# EAGLE board CDevBoard (EAGLE 9.6.2), part 1 of 2
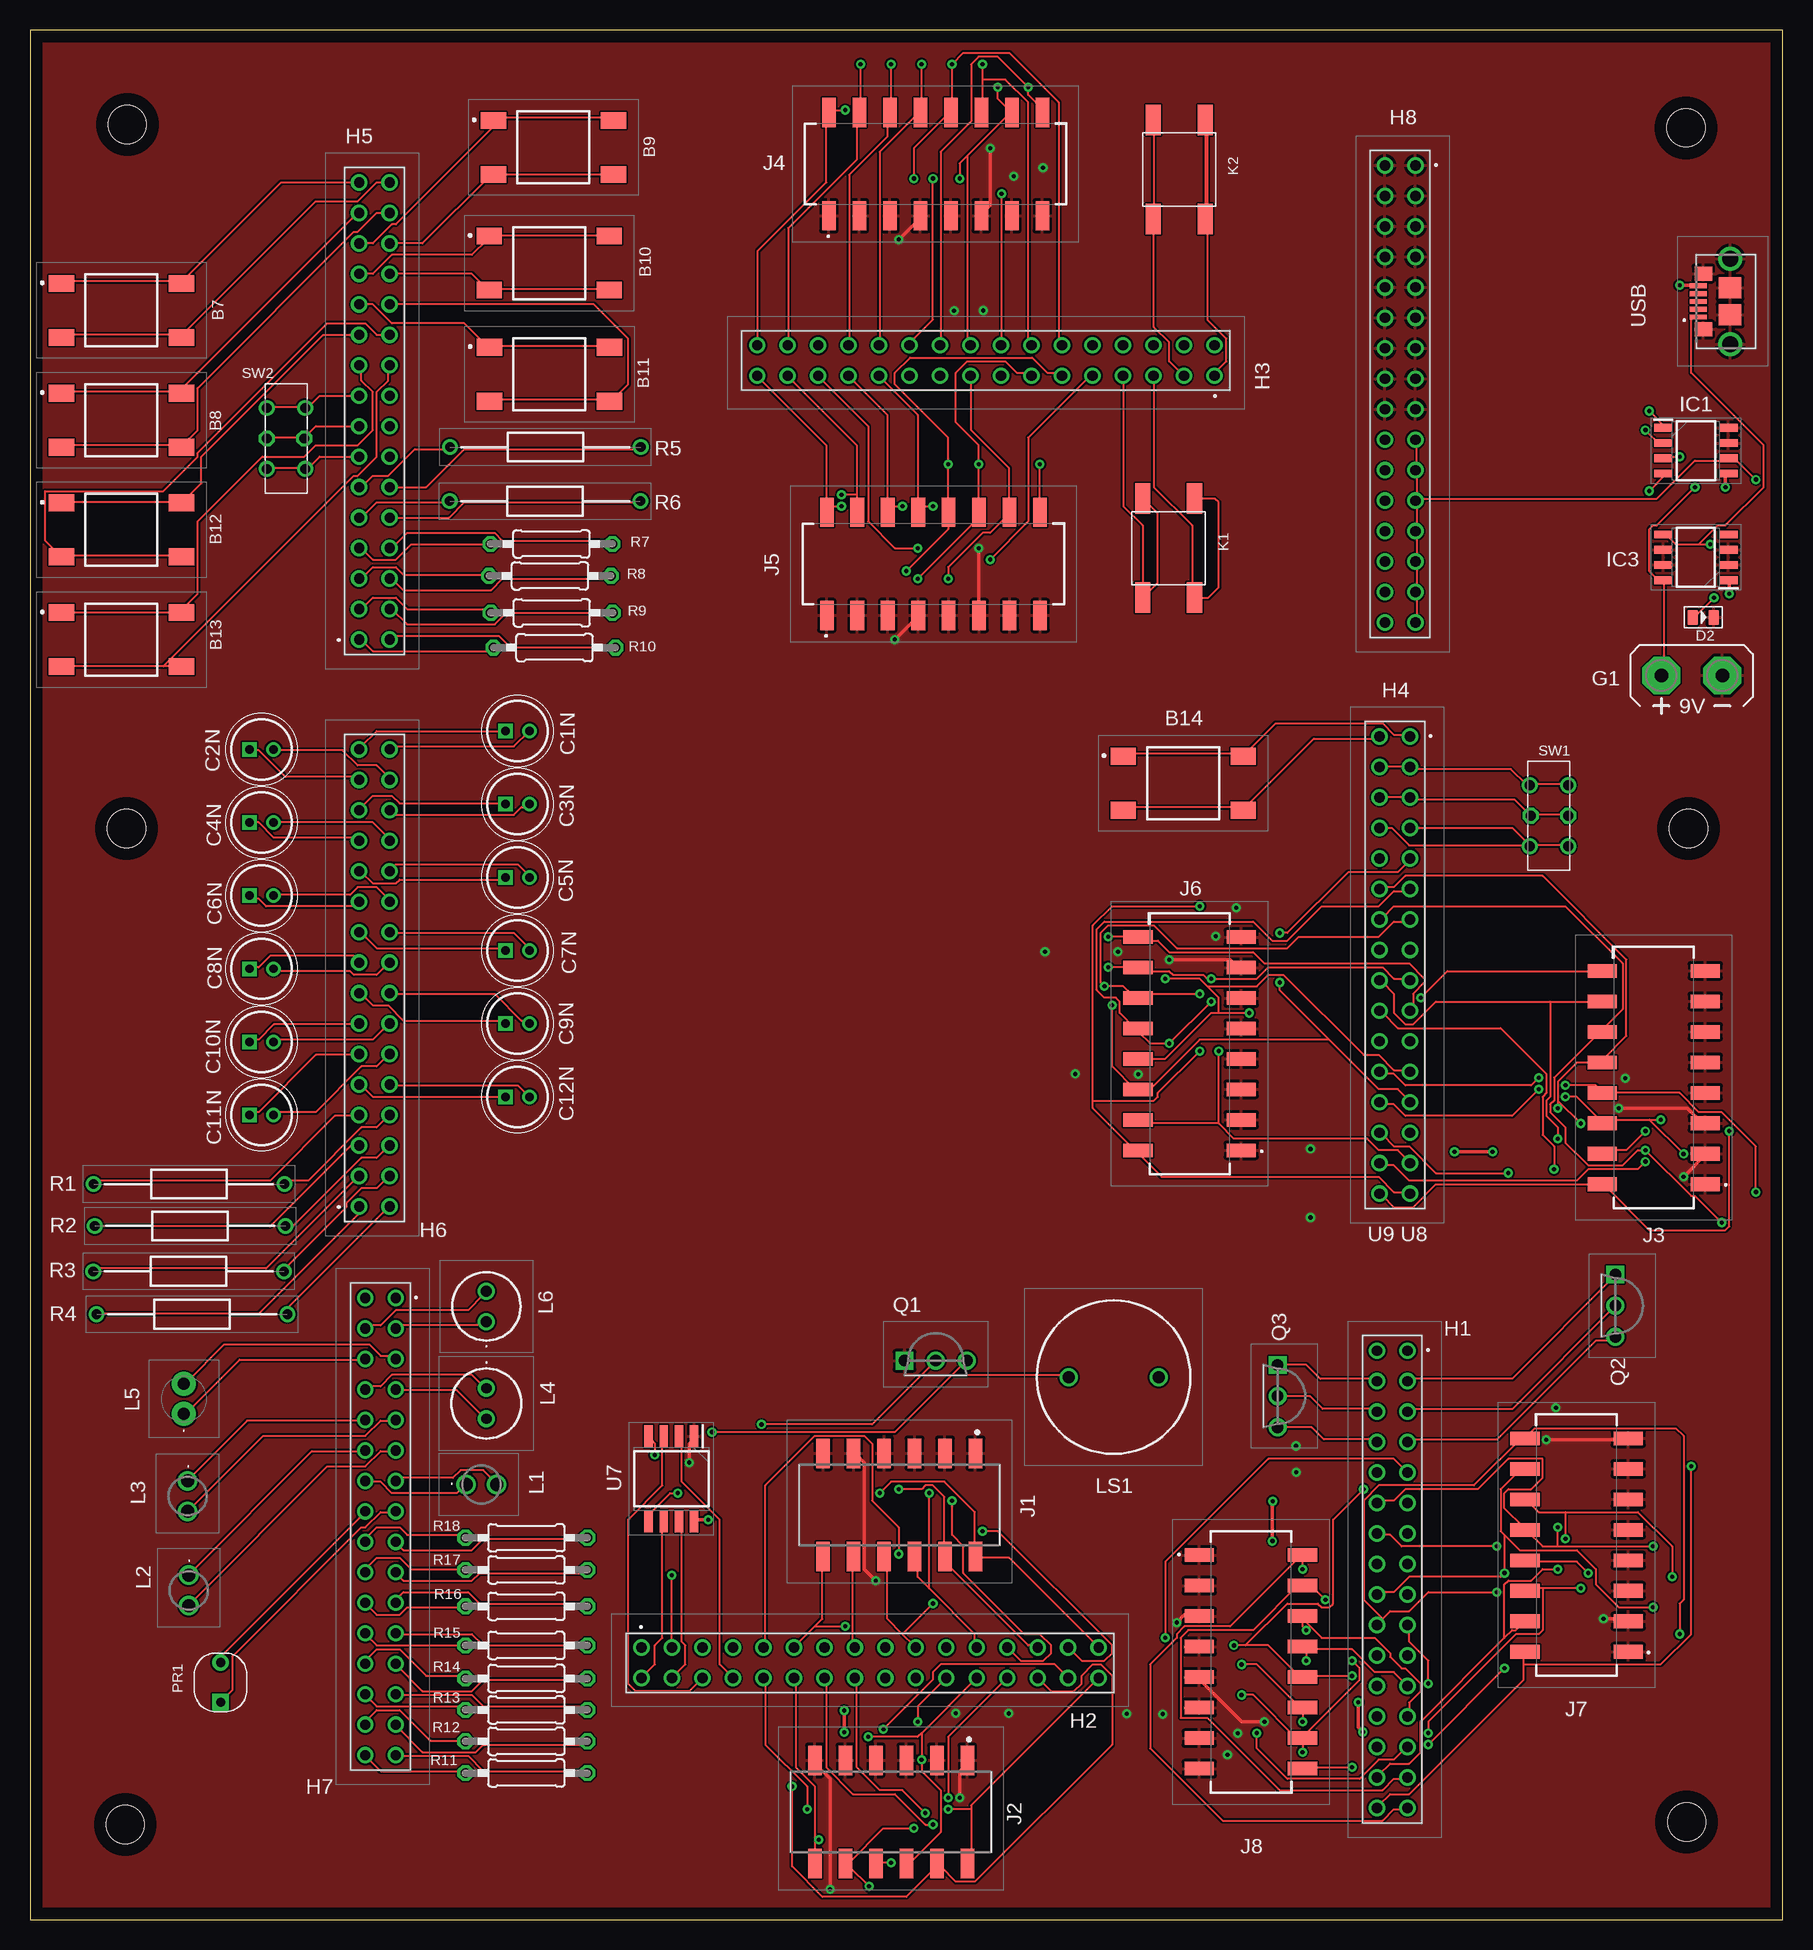
[diagram p2: board, top side]
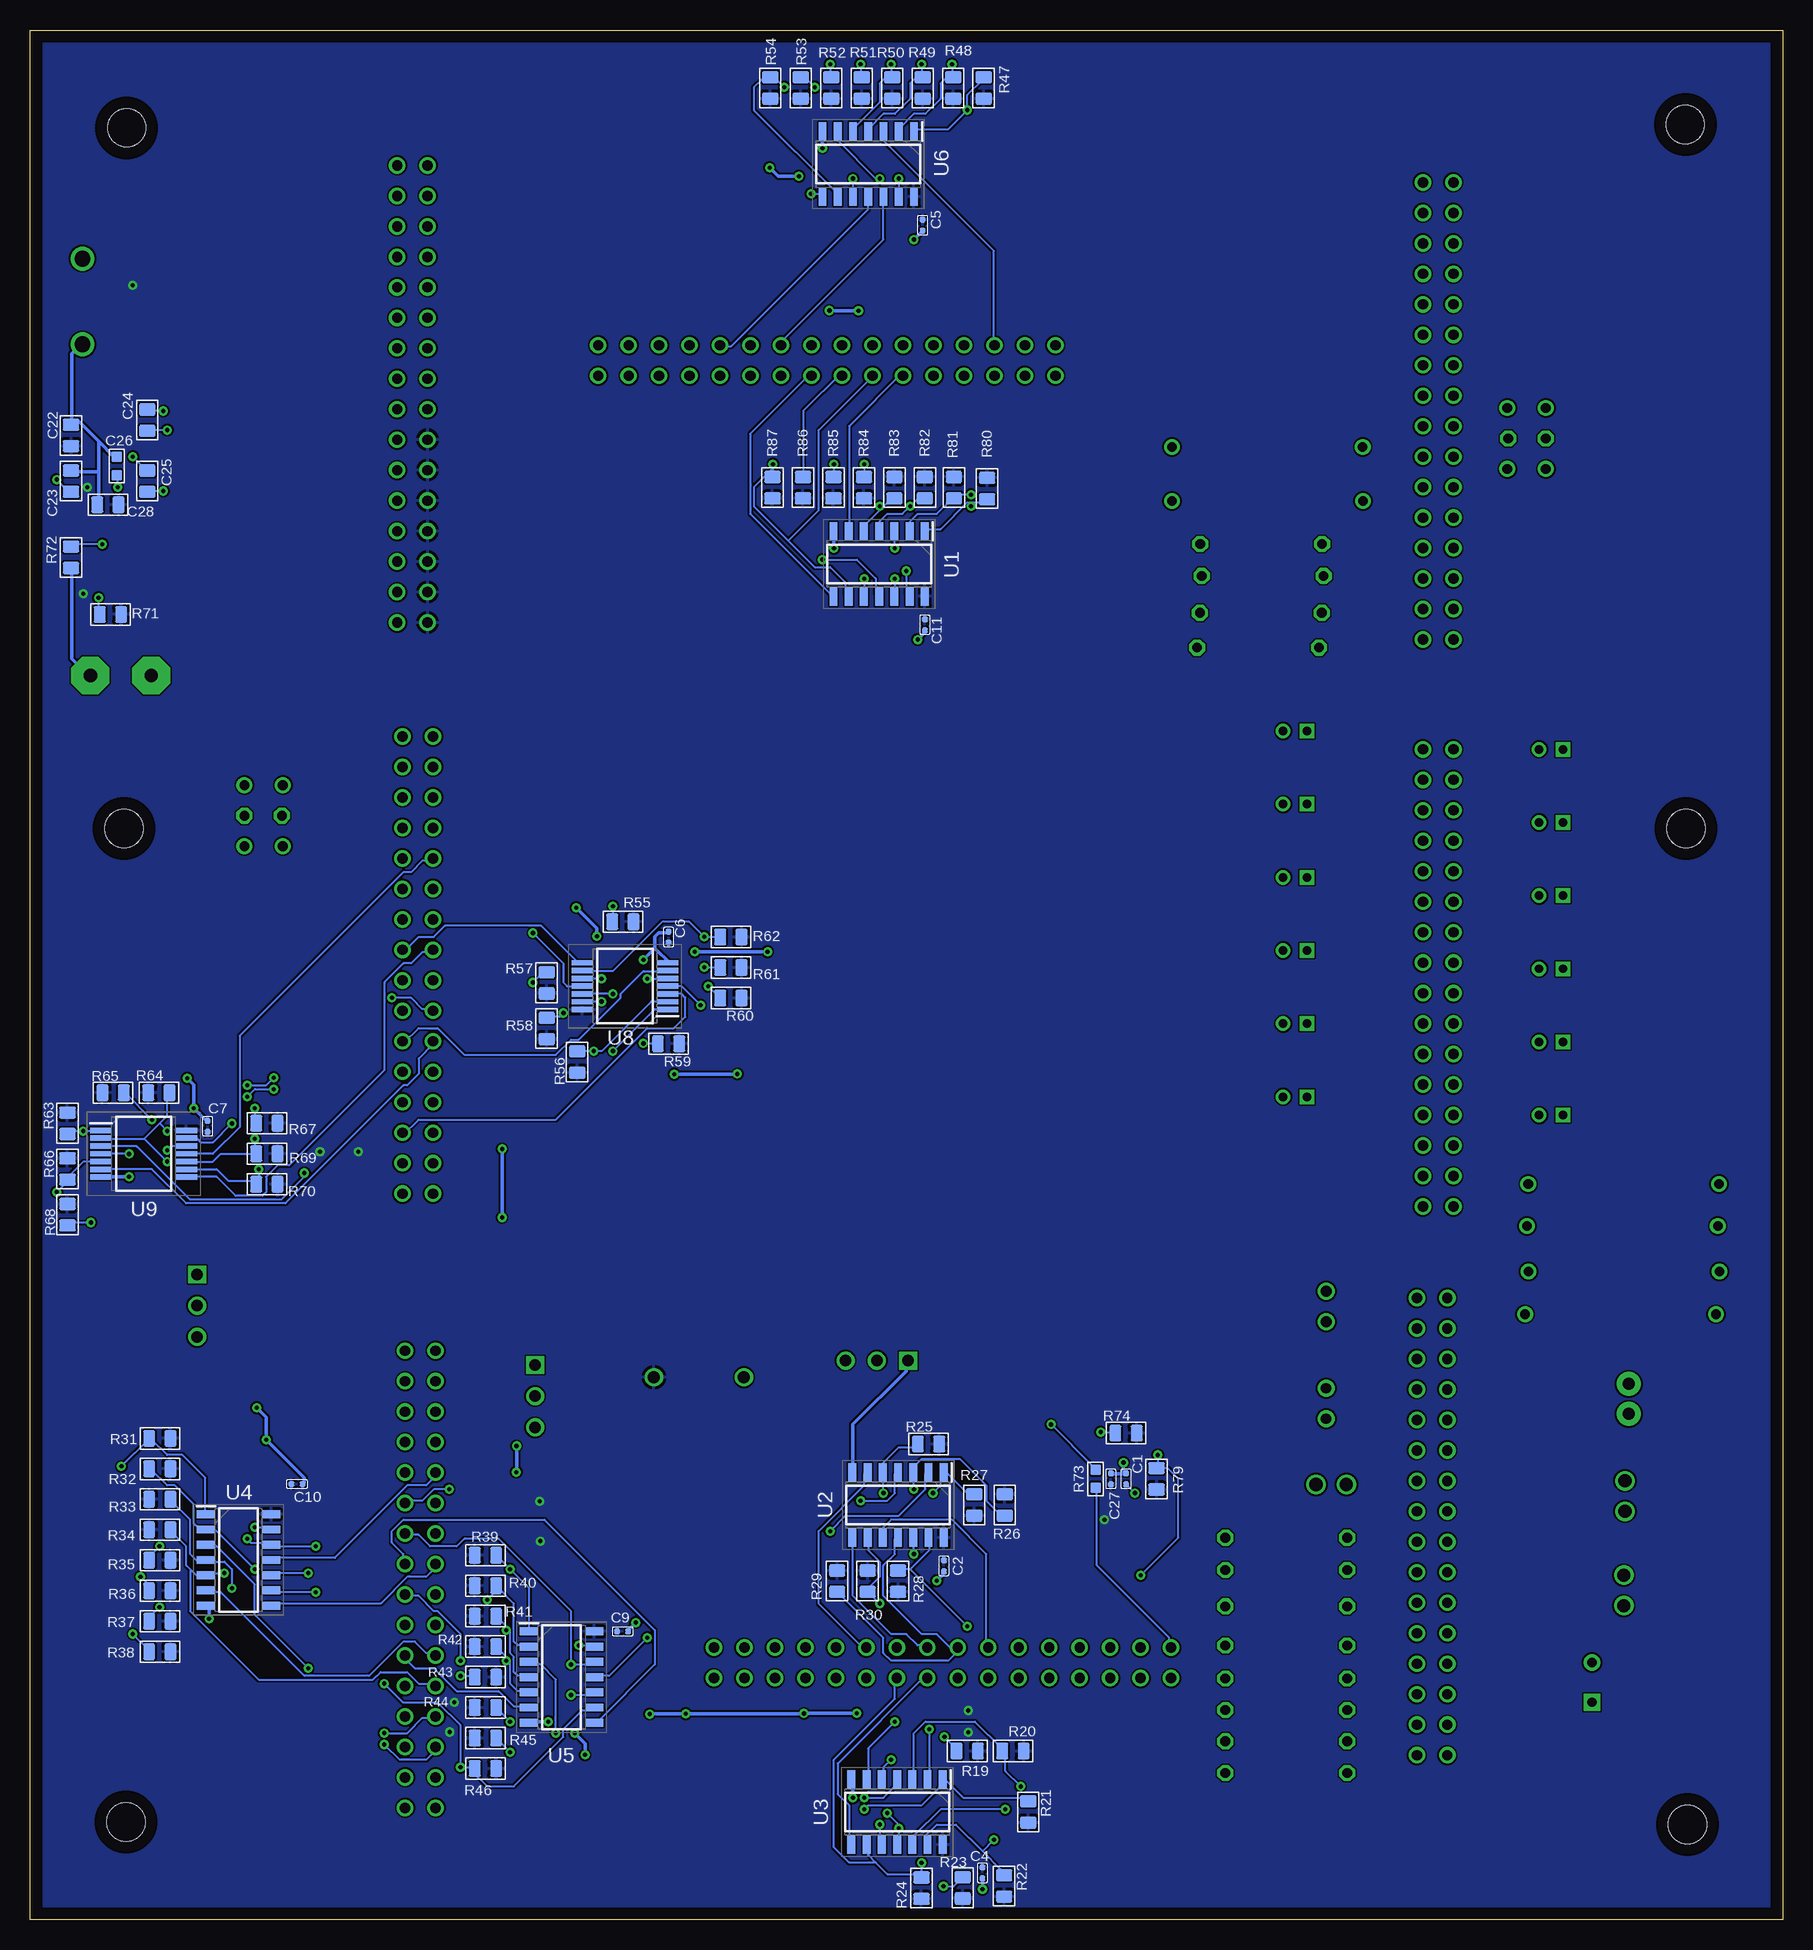
[diagram p3: board, bottom side, seen from below]

Size 146.05 x 157.48 mm. Coordinates in mm from the lower left corner, seen from the top.
Outline: 0,0 146.05,0 146.05,157.48 0,157.48 0,0
Copper layers (1*16): Top 0.035mm / dielectric 1.5mm / Bottom 0.035mm
Design rules "default": minimum track width 6mil, minimum drill 0.35mm, track to track 6mil, track to pad 6mil, pad to pad 6mil, via to via 6mil, smd to smd 6mil, copper to edge 40mil, drill to drill 6mil, minimum pad ring 10mil, minimum via ring 8mil, stop-mask expansion 4mil, vias tented up to drill 0mil, thermal gap 10mil
Net classes: 0 default: width 0.152 mm, drill 0.152 mm, clearance 0.152 mm; 1 Power: width 0.305 mm, drill 0.152 mm, clearance 0.152 mm to class 0, clearance 0.152 mm
Holes 3.17 mm at 7.94,7.94 8.04,90.93 138.22,90.93 8.11,149.6 138,149.33 138.06,8.14
tKeepout: area 0.1,0 to 15.8,15.9; area 0.2,83 to 15.9,98.9; area 130.3,83 to 146.1,98.9; area 0.2,141.7 to 16,157.5; area 130.1,141.4 to 145.9,157.3; area 130.2,0.2 to 145.9,16.1
bKeepout: area 0,-0.1 to 15.8,15.9; area 0.1,82.9 to 16,98.9; area 130.3,82.9 to 146.1,98.9; area 0.1,141.5 to 16,157.5; area 130,141.3 to 145.9,157.3; area 130.1,0.1 to 146,16.1

## Footprints (pad centres in the part's own frame; a part is rotated, then mirrored left to right if it is on the bottom)
13019317 = smd 2.1 x 1.4: 1 -5,2.25; 2 5,2.25; 3 -5,-2.25; 4 5,-2.25
C0402 = smd 0.5 x 0.5: 1 0,0.463; 2 0,-0.463
CAPPRD200W52D500H1250 = drill 0.7 pad 1.1 square: 1 0,0 | drill 0.7 pad 1.1: 2 2,0
CAPPRD200W50D500H1250 = drill 0.7 pad 1.1 square: 1 0,0 | drill 0.7 pad 1.1: 2 2,0
C0805 = smd 1.397 x 1.016: 1 0,0.889; 2 0,-0.889
C0603 = smd 0.889 x 0.889: 1 0,0.762; 2 0,-0.762
LED-0805 = smd 0.889 x 1.27: + -0.889,0; - 0.889,0
AB9V = drill 1.118 pad 3.15 octagon: + 0,2.54; - 0,-2.54
SLW-116-01-X = drill 0.86 pad 1.3: 1 0,0; 2 0,2.54; 3 -2.54,0; 4 -2.54,2.54; 5 -5.08,0; 6 -5.08,2.54; 7 -7.62,0; 8 -7.62,2.54; 9 -10.16,0; 10 -10.16,2.54; 11 -12.7,0; 12 -12.7,2.54; 13 -15.24,0; 14 -15.24,2.54; 15 -17.78,0; 16 -17.78,2.54; 17 -20.32,0; 18 -20.32,2.54; 19 -22.86,0; 20 -22.86,2.54; 21 -25.4,0; 22 -25.4,2.54; 23 -27.94,0; 24 -27.94,2.54; 25 -30.48,0; 26 -30.48,2.54; 27 -33.02,0; 28 -33.02,2.54; 29 -35.56,0; 30 -35.56,2.54; 31 -38.1,0; 32 -38.1,2.54
SOIC127P599X175-8N = smd 1.526 x 0.65: 1 -2.712,1.905; 2 -2.712,0.635; 3 -2.712,-0.635; 4 -2.712,-1.905; 5 2.712,-1.905; 6 2.712,-0.635; 7 2.712,0.635; 8 2.712,1.905
SOIC127P600X175-8N = smd 1.528 x 0.65: 1 -2.711,1.905; 2 -2.711,0.635; 3 -2.711,-0.635; 4 -2.711,-1.905; 5 2.711,-1.905; 6 2.711,-0.635; 7 2.711,0.635; 8 2.711,1.905
2196LPST = smd 1.13 x 2.44: 1 -6.35,-4.3; 2 -3.81,-4.3; 3 -1.27,-4.3; 4 1.27,-4.3; 5 3.81,-4.3; 6 6.35,-4.3; 7 6.35,4.3; 8 3.81,4.3; 9 1.27,4.3; 10 -1.27,4.3; 11 -3.81,4.3; 12 -6.35,4.3
2198MST = smd 1.13 x 2.44: 1 -8.89,-4.3; 2 -6.35,-4.3; 3 -3.81,-4.3; 4 -1.27,-4.3; 5 1.27,-4.3; 6 3.81,-4.3; 7 6.35,-4.3; 8 8.89,-4.3; 9 8.89,4.3; 10 6.35,4.3; 11 3.81,4.3; 12 1.27,4.3; 13 -1.27,4.3; 14 -3.81,4.3; 15 -6.35,4.3; 16 -8.89,4.3
SW4-SMD-6.0X6.0X5.0MM = smd 2.54 x 1.27: 1 -4.129,2.159; 2 -4.129,-2.159; 3 4.129,-2.159; 4 4.129,2.159
TLHR4400AS12Z = drill 1.09 pad 1.635: 1 0,0; 2 2.54,0
HLMP3401E0002 = drill 0.87 pad 1.414: 1 0,0; 2 0,-2.54
SLR343DCT32 = drill 1 pad 2: 1 0,0; 2 0,2.5
5219270F = drill 0.92 pad 1.431: 1 0,0; 2 0,2.54
TP1240051 = drill 1 pad 1.5: 1 0,0; 2 7.5,0
SNR2-3.0 = drill 0.762 pad 1.397 square: 1 -1.651,0 | drill 0.762 pad 1.397: 2 1.651,0
KA431AZTA = drill 0.96 pad 1.493 square: 1 0,0 | drill 0.96 pad 1.493: 2 2.6,0; 3 5.2,0
RESAD1590W60L630D240 = drill 0.8 pad 1.2: 1 0,0; 2 15.9,0
PR-D2.3XL6.5MM = drill 0.813 octagon: 1 -4.953,0; 2 5.207,0
R0805 = smd 1.397 x 1.016: 1 0,0.889; 2 0,-0.889
R0603 = smd 0.889 x 0.889: 1 0,0.762; 2 0,-0.762
SW6-2.54-9.0X3.5X3.2+2.0MM = drill 0.813 pad 1.27: CH1A -2.54,-1.6; CH1B 2.54,-1.6; CH2A -2.54,1.6; CH2B 2.54,1.6 | drill 0.813 pad 1.27 octagon: COM1 0,-1.6; COM2 0,1.524
SOIC127P600X175-14N = smd 1.525 x 0.65: 1 -2.712,3.81; 2 -2.712,2.54; 3 -2.712,1.27; 4 -2.712,0; 5 -2.712,-1.27; 6 -2.712,-2.54; 7 -2.712,-3.81; 8 2.712,-3.81; 9 2.712,-2.54; 10 2.712,-1.27; 11 2.712,0; 12 2.712,1.27; 13 2.712,2.54; 14 2.712,3.81
SOIC127P780X200-8N = smd 1.8 x 0.7: 1 -3.55,1.905; 2 -3.55,0.635; 3 -3.55,-0.635; 4 -3.55,-1.905; 5 3.55,-1.905; 6 3.55,-0.635; 7 3.55,0.635; 8 3.55,1.905
SOP65P780X200-14N = smd 1.8 x 0.45: 1 -3.55,1.95; 2 -3.55,1.3; 3 -3.55,0.65; 4 -3.55,0; 5 -3.55,-0.65; 6 -3.55,-1.3; 7 -3.55,-1.95; 8 3.55,-1.95; 9 3.55,-1.3; 10 3.55,-0.65; 11 3.55,0; 12 3.55,0.65; 13 3.55,1.3; 14 3.55,1.95
USB307530A = smd 0.4 x 1.4: 1 -1.3,2.65; 2 -0.65,2.65; 3 0,2.65; 4 0.65,2.65; 5 1.3,2.65 | drill 1.329 pad 1.85: MH1 -3.575,0; MH2 3.575,0 | smd 1.75 x 1.9: MP1 -1.125,0; MP2 1.125,0 | smd 1.15 x 1.45: MP3 -2.32,2.23; MP4 2.32,2.23

## Placement (x,y rotation side)
B7  1301.9317  [13019317]  7.62,134.11 0 top
B8  1301.9317  [13019317]  7.62,124.97 0 top
B9  1301.9317  [13019317]  43.62,147.69 0 top
B10  1301.9317  [13019317]  43.28,138.06 0 top
B11  1301.9317  [13019317]  43.29,128.8 0 top
B12  1301.9317  [13019317]  7.62,115.82 0 top
B13  1301.9317  [13019317]  7.62,106.68 0 top
B14  1301.9317  [13019317]  96.1,94.72 0 top
C1  100nf  [C0402]  54.71,36.74 0 bottom
C1N  0.1uF  [CAPPRD200W52D500H1250]  39.62,99.06 0 top
C2  100nf  [C0402]  69.9,29.49 0 bottom
C2N  0.22uF  [CAPPRD200W52D500H1250]  18.29,97.54 0 top
C3N  0.47uF  [CAPPRD200W52D500H1250]  39.62,92.96 0 top
C4  100nf  [C0402]  66.68,3.9 0 bottom
C4N  1uF  [CAPPRD200W52D500H1250]  18.29,91.44 0 top
C5  100nf  [C0402]  71.66,141.22 0 bottom
C5N  2.2uF  [CAPPRD200W52D500H1250]  39.62,86.87 0 top
C6  100nf  [C0402]  92.83,81.89 180 bottom
C6N  4.7uF  [CAPPRD200W52D500H1250]  18.29,85.34 0 top
C7  100nf  [C0402]  131.25,66.12 180 bottom
C7N  10uF  [CAPPRD200W50D500H1250]  39.62,80.77 0 top
C8N  22uF  [CAPPRD200W52D500H1250]  18.29,79.25 0 top
C9  100nf  [C0402]  96.66,24.03 90 bottom
C9N  47uF  [CAPPRD200W52D500H1250]  39.62,74.68 0 top
C10  100nf  [C0402]  123.8,36.31 90 bottom
C10N  100uF  [CAPPRD200W52D500H1250]  18.29,73.15 0 top
C11  100nf  [C0402]  71.48,107.91 0 bottom
C11N  470uF  [CAPPRD200W52D500H1250]  18.29,67.06 0 top
C12N  1000uF  [CAPPRD200W52D500H1250]  39.62,68.58 0 top
C22  10uf  [C0805]  142.63,123.69 0 bottom
C23  10uf  [C0805]  142.63,119.88 0 bottom
C24  1uf  [C0805]  136.28,124.96 0 bottom
C25  1uf  [C0805]  136.28,119.88 0 bottom
C26  100nf  [C0603]  138.82,121.15 0 bottom
C27  100nf  [C0402]  55.98,36.74 0 bottom
C28  10uf  [C0805]  139.56,117.92 270 bottom
D2  YELLOW-0805  [LED-0805]  139.44,108.54 0 top
G1  AB9V  [AB9V]  138.48,103.69 90 top
H1  SLW-116-01-T-D  [SLW-116-01-X]  114.79,47.42 90 top
H2  SLW-116-01-T-D  [SLW-116-01-X]  50.96,22.68 180 top
H3  SLW-116-01-T-D  [SLW-116-01-X]  98.7,128.67 0 top
H4  SLW-116-01-T-D  [SLW-116-01-X]  115.01,98.61 90 top
H5  SLW-116-01-T-D  [SLW-116-01-X]  27.43,106.68 270 top
H6  SLW-116-01-T-D  [SLW-116-01-X]  27.43,59.44 270 top
H7  SLW-116-01-T-D  [SLW-116-01-X]  30.48,51.82 90 top
H8  SLW-116-01-T-D  [SLW-116-01-X]  115.45,146.2 90 top
IC1  LTC1263CS8#PBF  [SOIC127P599X175-8N]  138.82,122.42 0 top
IC3  KF50BD-TR  [SOIC127P600X175-8N]  138.82,113.53 180 top
J1  219-6LPST  [2196LPST]  72.44,34.57 180 top
J2  219-6LPST  [2196LPST]  71.76,8.98 180 top
J3  219-8MST  [2198MST]  135.31,70.18 90 top
J4  219-8MST  [2198MST]  75.47,146.3 0 top
J5  219-8MST  [2198MST]  75.29,112.99 0 top
J6  219-8MST  [2198MST]  96.64,73 90 top
J7  219-8MST  [2198MST]  128.88,31.23 90 top
J8  219-8MST  [2198MST]  101.74,21.49 270 top
K1  [SW4-SMD-6.0X6.0X5.0MM]  94.88,114.31 90 top
K2  [SW4-SMD-6.0X6.0X5.0MM]  95.77,145.85 90 top
L1  TLHR4400-AS12Z  [TLHR4400AS12Z]  36.35,36.27 0 top
L2  TLHR4400-AS12Z  [TLHR4400AS12Z]  13.23,28.72 270 top
L3  TLHR4400-AS12Z  [TLHR4400AS12Z]  13.14,36.58 270 top
L4  HLMP-3401-E0002  [HLMP3401E0002]  38.03,44.29 0 top
L5  SLR-343DCT32  [SLR343DCT32]  12.82,42.15 0 top
L6  521-9270F  [5219270F]  38.03,49.85 0 top
LS1  TP124005-1  [TP1240051]  94.05,45.22 180 top
PR1  PHOTORESISTOR-5528-10K  [SNR2-3.0]  15.88,19.79 90 top
Q1  PN2222ATF  [KA431AZTA]  72.88,46.59 0 top
Q2  PN2222ATF  [KA431AZTA]  132.12,53.77 270 top
Q3  PN2222ATF  [KA431AZTA]  103.96,46.23 270 top
R1  510K  [RESAD1590W60L630D240]  5.3,61.31 0 top
R2  510K  [RESAD1590W60L630D240]  5.4,57.82 0 top
R3  22K  [RESAD1590W60L630D240]  5.27,54.03 0 top
R4  22K  [RESAD1590W60L630D240]  5.55,50.46 0 top
R5  220K  [RESAD1590W60L630D240]  34.99,122.72 0 top
R6  220K  [RESAD1590W60L630D240]  34.97,118.22 0 top
R7  100R  [PR-D2.3XL6.5MM]  43.33,114.65 0 top
R8  100R  [PR-D2.3XL6.5MM]  43.2,111.99 0 top
R9  470R  [PR-D2.3XL6.5MM]  43.35,108.91 0 top
R10  470R  [PR-D2.3XL6.5MM]  43.58,106.01 0 top
R11  1K  [PR-D2.3XL6.5MM]  41.49,12.23 180 top
R12  1K  [PR-D2.3XL6.5MM]  41.49,14.87 180 top
R13  2.2K  [PR-D2.3XL6.5MM]  41.49,17.48 180 top
R14  2.2K  [PR-D2.3XL6.5MM]  41.49,20.1 180 top
R15  4.7K  [PR-D2.3XL6.5MM]  41.49,22.86 180 top
R16  4.7K  [PR-D2.3XL6.5MM]  41.49,26.11 180 top
R17  10K  [PR-D2.3XL6.5MM]  41.49,29.15 180 top
R18  10K  [PR-D2.3XL6.5MM]  41.49,31.83 180 top
R19  1K  [R0805]  67.95,14.06 90 bottom
R20  1K  [R0805]  64.14,14.06 90 bottom
R21  1K  [R0805]  62.87,8.98 0 bottom
R22  1K  [R0805]  64.87,2.82 0 bottom
R23  1K  [R0805]  68.33,2.66 0 bottom
R24  1K  [R0805]  71.76,2.63 0 bottom
R25  1K  [R0805]  71.17,39.65 90 bottom
R26  1K  [R0805]  64.82,34.57 180 bottom
R27  1K  [R0805]  67.36,34.57 0 bottom
R28  1K  [R0805]  73.71,28.22 0 bottom
R29  1K  [R0805]  78.79,28.22 180 bottom
R30  1K  [R0805]  76.25,28.22 180 bottom
R31  1K  [R0805]  135.23,40.12 90 bottom
R32  1K  [R0805]  135.23,37.58 270 bottom
R33  1K  [R0805]  135.23,35.04 270 bottom
R34  1K  [R0805]  135.23,32.5 270 bottom
R35  1K  [R0805]  135.23,29.96 270 bottom
R36  1K  [R0805]  135.23,27.42 270 bottom
R37  1K  [R0805]  135.23,24.88 270 bottom
R38  1K  [R0805]  135.23,22.34 270 bottom
R39  1K  [R0805]  108.09,30.38 270 bottom
R40  1K  [R0805]  108.09,27.84 90 bottom
R41  1K  [R0805]  108.09,25.3 270 bottom
R42  1K  [R0805]  108.09,22.76 270 bottom
R43  1K  [R0805]  108.09,20.22 270 bottom
R44  1K  [R0805]  108.09,17.68 90 bottom
R45  1K  [R0805]  108.09,15.14 90 bottom
R46  1K  [R0805]  108.09,12.6 270 bottom
R47  1K  [R0805]  66.58,152.65 0 bottom
R48  1K  [R0805]  69.12,152.65 180 bottom
R49  1K  [R0805]  71.66,152.65 0 bottom
R50  1K  [R0805]  74.2,152.65 0 bottom
R51  1K  [R0805]  76.74,152.65 180 bottom
R52  1K  [R0805]  79.28,152.65 180 bottom
R53  1K  [R0805]  81.82,152.65 180 bottom
R54  1K  [R0805]  84.36,152.65 180 bottom
R55  1K  [R0805]  96.64,83.16 90 bottom
R56  1K  [R0805]  100.45,71.48 180 bottom
R57  1K  [R0805]  102.99,78.08 0 bottom
R58  1K  [R0805]  102.99,74.27 0 bottom
R59  1K  [R0805]  92.83,73 270 bottom
R60  1K  [R0805]  87.64,76.81 270 bottom
R61  1K  [R0805]  87.64,79.35 270 bottom
R62  1K  [R0805]  87.64,81.89 270 bottom
R63  1K  [R0805]  142.93,66.37 180 bottom
R64  1K  [R0805]  135.31,68.91 90 bottom
R65  1K  [R0805]  139.12,68.91 270 bottom
R66  1K  [R0805]  142.93,62.56 180 bottom
R67  1K  [R0805]  126.31,66.37 270 bottom
R68  1K  [R0805]  142.93,58.75 0 bottom
R69  1K  [R0805]  126.31,63.83 270 bottom
R70  1K  [R0805]  126.31,61.29 270 bottom
R71  1K  [R0805]  139.34,108.78 270 bottom
R72  1K  [R0805]  142.63,113.53 0 bottom
R73  51K  [R0603]  57.25,36.74 180 bottom
R74  1K  [R0805]  54.71,40.55 90 bottom
R79  1K  [R0805]  52.17,36.74 180 bottom
R80  1K  [R0805]  66.29,119.26 180 bottom
R81  1K  [R0805]  69.06,119.34 0 bottom
R82  1K  [R0805]  71.48,119.34 180 bottom
R83  1K  [R0805]  74.02,119.34 180 bottom
R84  1K  [R0805]  76.56,119.34 180 bottom
R85  1K  [R0805]  79.1,119.34 180 bottom
R86  1K  [R0805]  81.64,119.34 180 bottom
R87  1K  [R0805]  84.18,119.34 180 bottom
SW1  [SW6-2.54-9.0X3.5X3.2+2.0MM]  126.58,92.01 90 top
SW2  [SW6-2.54-9.0X3.5X3.2+2.0MM]  21.34,123.44 270 top
U1  SN74AC04MDREP  [SOIC127P600X175-14N]  75.29,112.99 270 bottom
U2  SN74AC04MDREP  [SOIC127P600X175-14N]  73.71,34.57 270 bottom
U3  SN74AC04MDREP  [SOIC127P600X175-14N]  73.79,8.98 270 bottom
U4  SN74AC08MDREP  [SOIC127P600X175-14N]  128.67,29.99 0 bottom
U5  SN74AC08MDREP  [SOIC127P600X175-14N]  101.74,20.22 0 bottom
U6  SN74AC04MDREP  [SOIC127P600X175-14N]  76.2,146.3 270 bottom
U7  NE555PSRE4  [SOIC127P780X200-8N]  53.44,36.74 270 top
U8  SN74AC86DBR  [SOP65P780X200-14N]  96.47,77.8 180 bottom
U9  SN74AC86DBR  [SOP65P780X200-14N]  136.58,63.83 0 bottom
USB  USB3075-30-A  [USB307530A]  141.67,134.86 90 top